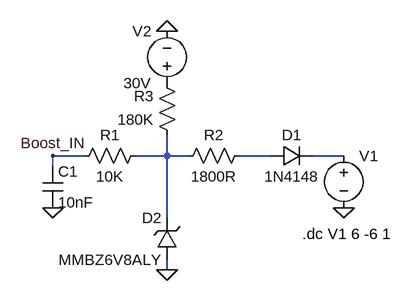
[diagram p0: schematic Boost_Input.asc]
Boost_Input.asc, the LTspice schematic file:
Version 4
SHEET 1 880 680
WIRE 160 144 112 144
WIRE 288 144 288 112
WIRE 288 144 240 144
WIRE 320 144 288 144
WIRE 448 144 400 144
WIRE 560 144 512 144
WIRE 112 160 112 144
WIRE 288 240 288 144
WIRE 288 320 288 304
FLAG 112 224 0
FLAG 288 320 0
FLAG 560 224 0
FLAG 288 -48 0
FLAG 112 144 Boost_IN
SYMBOL res 256 128 R90
WINDOW 0 0 56 VBottom 2
WINDOW 3 32 56 VTop 2
SYMATTR InstName R1
SYMATTR Value 10K
SYMBOL res 416 128 R90
WINDOW 0 0 56 VBottom 2
WINDOW 3 32 56 VTop 2
SYMATTR InstName R2
SYMATTR Value 1800R
SYMBOL res 304 128 R180
WINDOW 0 36 76 Left 2
WINDOW 3 36 40 Left 2
SYMATTR InstName R3
SYMATTR Value 180K
SYMBOL diode 448 160 R270
WINDOW 0 32 32 VTop 2
WINDOW 3 0 32 VBottom 2
SYMATTR InstName D1
SYMATTR Value 1N4148
SYMBOL cap 96 160 R0
SYMATTR InstName C1
SYMATTR Value 10nF
SYMBOL zener 304 304 R180
WINDOW 0 24 64 Left 2
WINDOW 3 24 0 Left 2
SYMATTR InstName D2
SYMATTR Value MMBZ6V8ALY
SYMBOL voltage 560 128 R0
WINDOW 123 0 0 Left 0
WINDOW 39 0 0 Left 0
SYMATTR InstName V1
SYMATTR Value ""
SYMBOL voltage 288 48 R180
WINDOW 0 24 96 Left 2
WINDOW 3 24 16 Left 2
WINDOW 123 0 0 Left 0
WINDOW 39 0 0 Left 0
SYMATTR InstName V2
SYMATTR Value 30V
TEXT 496 264 Left 2 !.dc V1 6 -6 1

The netlist it stands for:
* Boost_Input.asc
R1 N001 Boost_IN 10K
R2 N002 N001 1800R
R3 N001 P001 180K
D1 N002 N003 1N4148
C1 Boost_IN 0 10nF
D2 0 N001 MMBZ6V8ALY
V1 N003 0
V2 P001 0 30V
.model D D
.lib standard.dio
.dc V1 6 -6 1
.backanno
.end